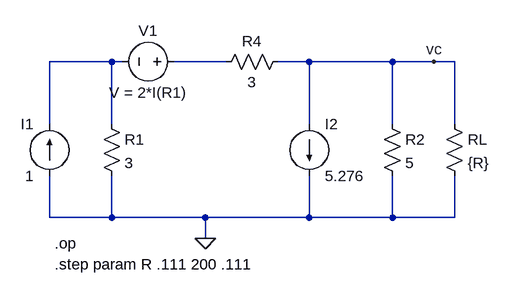
[diagram p0: schematic Question_2c.asc]
Question_2c.asc, the LTspice schematic file:
Version 4
SHEET 1 880 680
WIRE 176 176 80 176
WIRE 192 176 176 176
WIRE 352 176 272 176
WIRE 480 176 432 176
WIRE 608 176 480 176
WIRE 672 176 608 176
WIRE 704 176 672 176
WIRE 80 272 80 176
WIRE 176 272 176 176
WIRE 480 272 480 176
WIRE 608 272 608 176
WIRE 704 272 704 176
WIRE 80 416 80 352
WIRE 176 416 176 352
WIRE 176 416 80 416
WIRE 320 416 176 416
WIRE 480 416 480 352
WIRE 480 416 320 416
WIRE 608 416 608 352
WIRE 608 416 480 416
WIRE 704 416 704 352
WIRE 704 416 608 416
WIRE 320 448 320 416
FLAG 320 448 0
FLAG 672 176 vc
SYMBOL current 80 352 R180
WINDOW 0 24 80 Left 2
WINDOW 3 24 0 Left 2
SYMATTR InstName I1
SYMATTR Value 1
SYMBOL current 480 272 R0
SYMATTR InstName I2
SYMATTR Value 5.276
SYMBOL voltage 288 176 R90
WINDOW 0 -32 56 VBottom 2
WINDOW 3 32 56 VTop 2
SYMATTR InstName V1
SYMATTR Value V = 2*I(R1)
SYMBOL res 160 256 R0
SYMATTR InstName R1
SYMATTR Value 3
SYMBOL res 592 256 R0
SYMATTR InstName R2
SYMATTR Value 5
SYMBOL res 688 256 R0
SYMATTR InstName RL
SYMATTR Value {R}
SYMBOL res 448 160 R90
WINDOW 0 0 56 VBottom 2
WINDOW 3 32 56 VTop 2
SYMATTR InstName R4
SYMATTR Value 3
TEXT 88 456 Left 2 !.op
TEXT 88 488 Left 2 !.step param R .111 200 .111

The netlist it stands for:
* Question_2c.asc
I1 0 N001 1
I2 vc 0 5.276
V1 N002 N001 V = 2*I(R1)
R1 N001 0 3
R2 vc 0 5
RL vc 0 {R}
R4 vc N002 3
.op
.step param R .111 200 .111
.backanno
.end